# EasyEDA Pro project TLV3501比较器.eprj

# Schematic Schematic1
Board Name: Board1; Create Date: 2025-02-21; Page Name: P1; Project Name: TLV3501比较器; Schematic Name: Schematic1; Update Date: 2025-02-21; Company: 嘉立创EDA; Page Size: A4; Version: V1.0
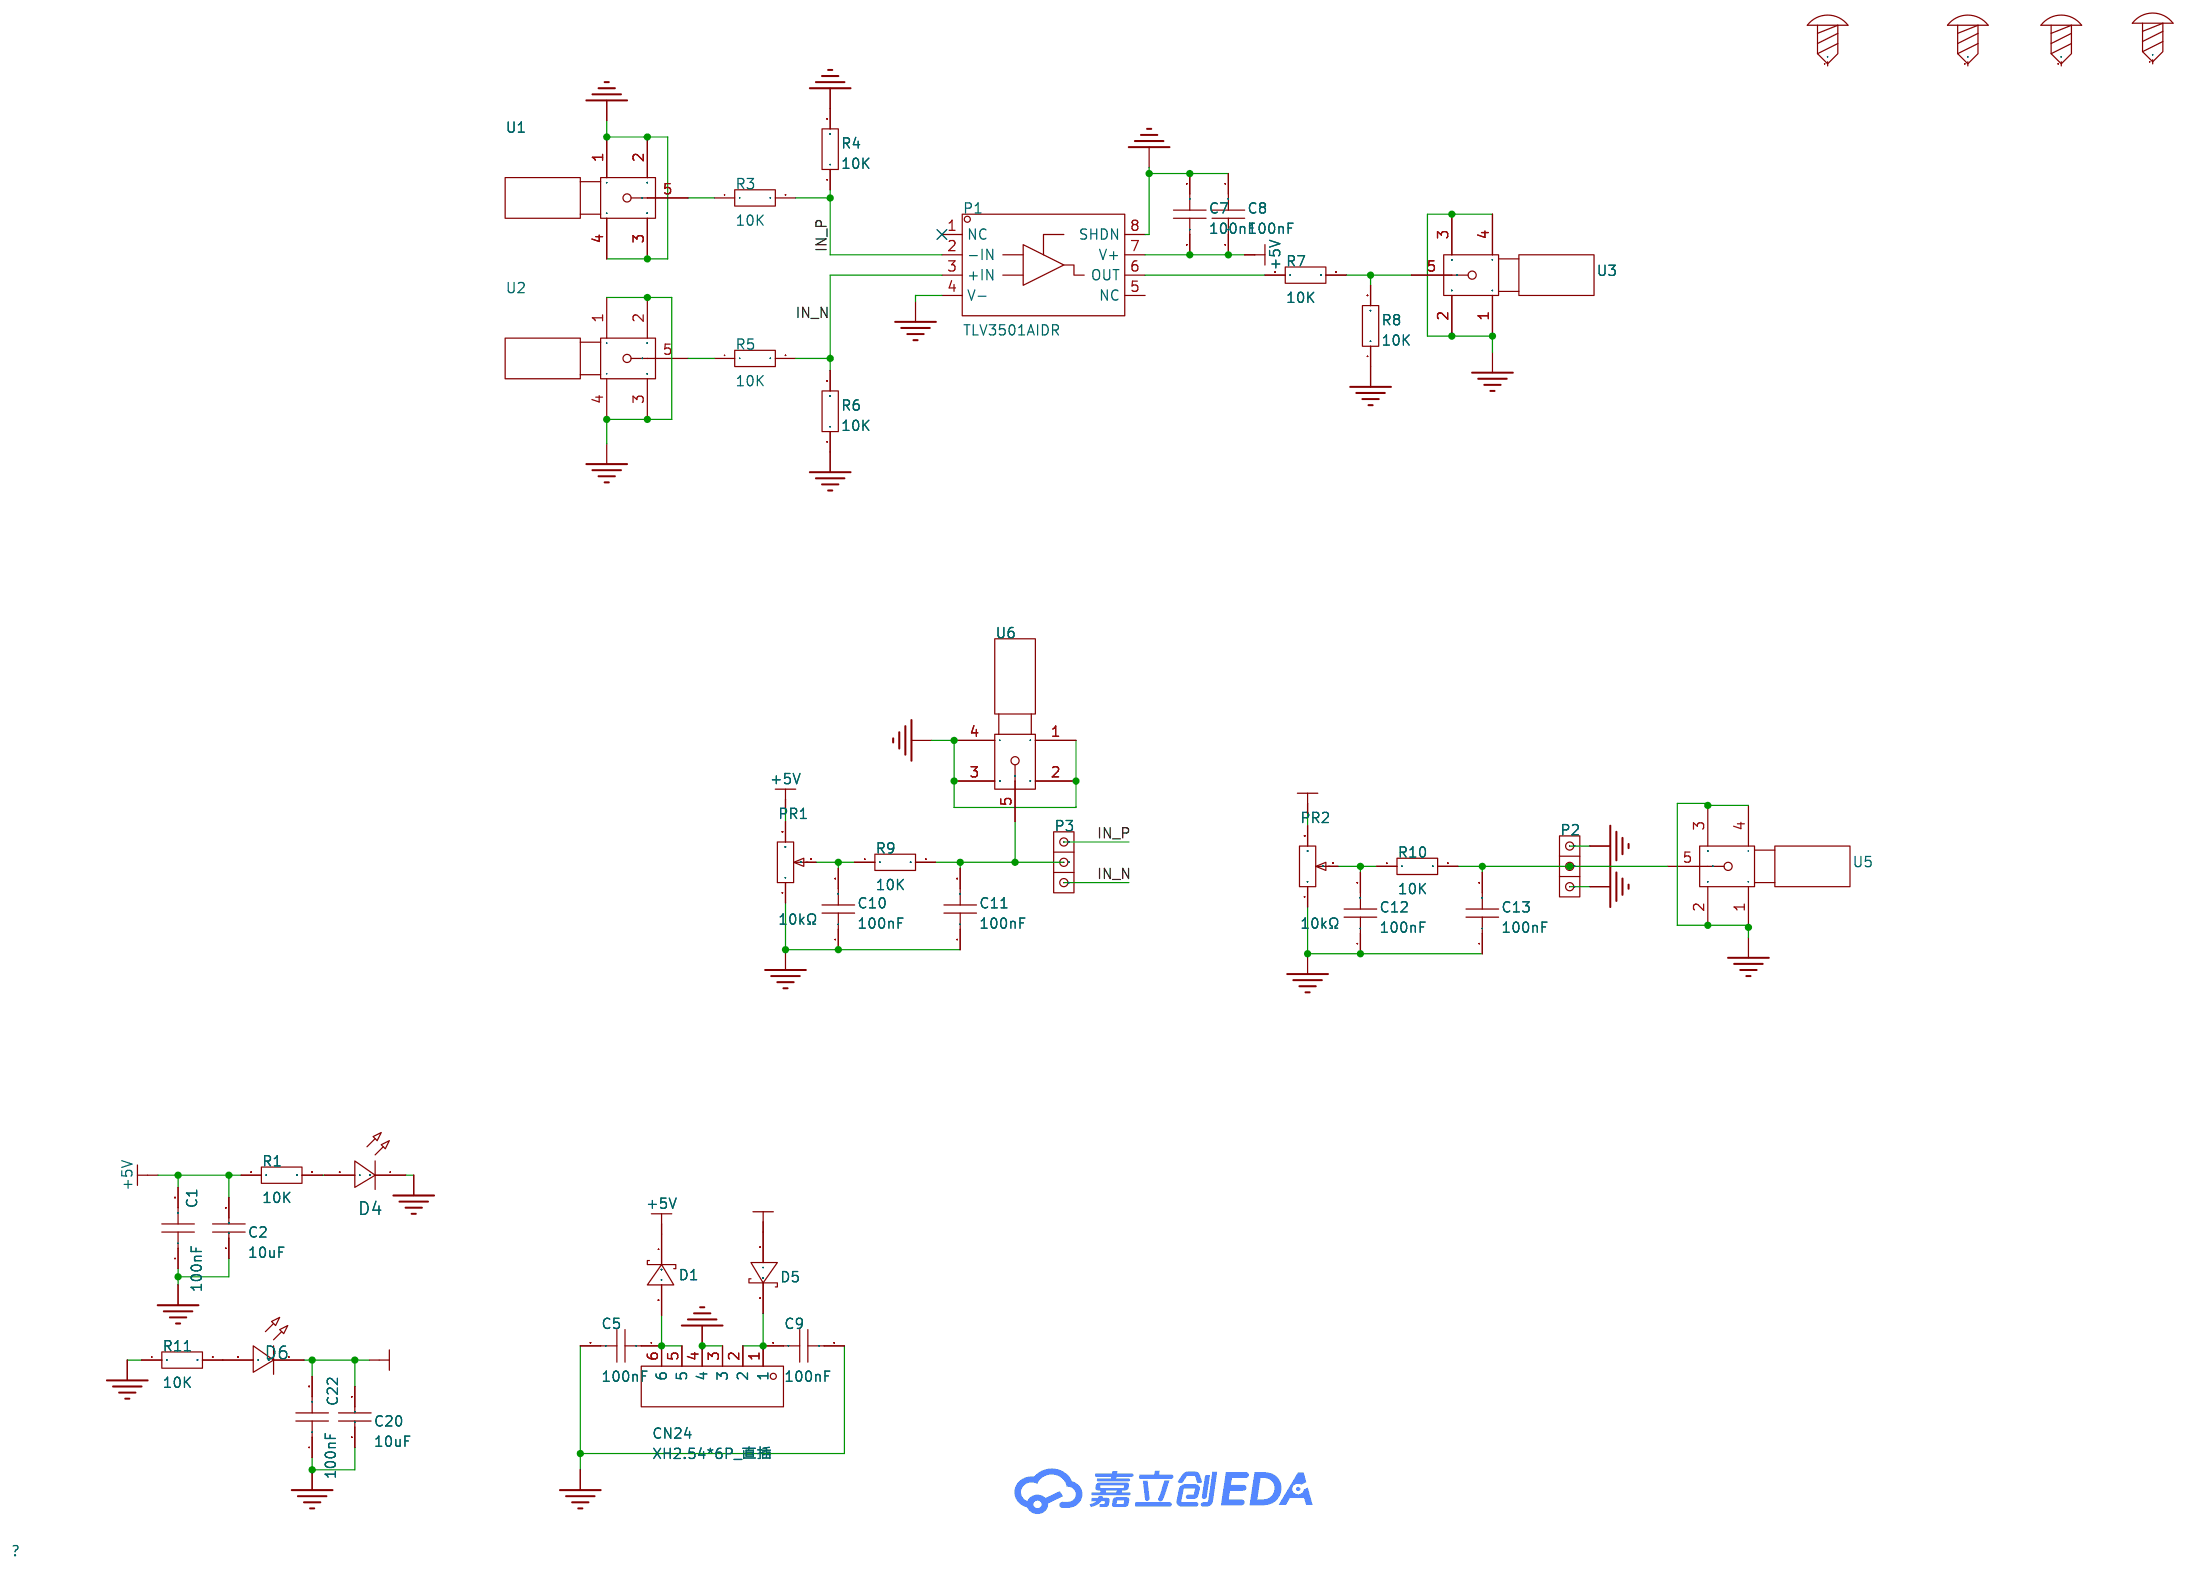
[diagram p0: schematic sheet]

## Parts
C1  100nF  [R0805]
C2  10uF  [C1210]
C5  100nF  [R0805]
C7  100nF  [R0805]
C8  100nF  [R0805]
C9  100nF  [R0805]
C10  100nF  [R0805]
C11  100nF  [R0805]
C12  100nF  [R0805]
C13  100nF  [R0805]
C20  10uF  [C1210]
C22  100nF  [R0805]
CN24  XH2.54*6P_直插  [CONN-TH_XH2.54-6P]
D1  SD103AWS  [SOD-323_L1.8-W1.3-LS2.5-RD]
D4  -  [LED_0805]
D5  SD103AWS  [SOD-323_L1.8-W1.3-LS2.5-RD]
D6  -  [LED_0805]
P1  TLV3501AIDR  [SOP-8_L4.9-W3.9-P1.27-LS6.0-BL]
P2  -  [1*3跳线]
P3  -  [1*3跳线]
PR1  10kΩ  [R_3296]
PR2  10kΩ  [R_3296]
R1  10K  [R0805]
R3  10K  [R0805]
R4  10K  [R0805]
R5  10K  [R0805]
R6  10K  [R0805]
R7  10K  [R0805]
R8  10K  [R0805]
R9  10K  [R0805]
R10  10K  [R0805]
R11  10K  [R0805]
SCREW1  -  [M3螺丝]
SCREW2  -  [M3螺丝]
SCREW3  -  [M3螺丝]
SCREW4  -  [M3螺丝]
U1  -  [SMA]
U2  -  [SMA]
U3  -  [SMA]
U5  -  [SMA]
U6  -  [SMA]

## Library data of the parts
C1 C5 C7-C13 C22 = CAP_0805: Supplier Footprint: 0805
C2 C20 = CL32B106KAJNNNE: 容值:10uF;精度:±10%;额定电压:25V;材质(温度系数):X7R;; LCSC Part Name: 10uF ±10% 25V; Supplier Part: C39232; Manufacturer: SAMSUNG(三星); Supplier Footprint: 1210; JLCPCB Part Class: 扩展库; Datasheet: https://atta.szlcsc.com/upload/public/pdf/source/20160218/1457707763339.pdf; Supplier: LCSC; Tolerance: ±10%; Voltage Rated: 25V; Temperature Coefficient: X7R
CN24 = XH2.54*6P_直插: Supplier Part: C9900008614; Supplier Footprint: XH2.54_6P; JLCPCB Part Class: 扩展库; Supplier: LCSC
D1 D5 = SD103AWS_C181207: 正向压降(Vf):600mV@200mA;直流反向耐压(Vr):40V;整流电流:350mA;; LCSC Part Name: 电压:40V 电流:350mA 丝印S4; Supplier Part: C181207; Manufacturer: Hottech(合科泰); Supplier Footprint: SOD-323; JLCPCB Part Class: 扩展库; Datasheet: https://atta.szlcsc.com/upload/public/pdf/source/20240513/4691873FBB9173EFBCF4C6FD4BBA1025.pdf; Supplier: LCSC; Forward Voltage (Vf@If): 600mV@200mA; Reverse Voltage (Vr): 40V; Rectified Current: 350mA
D4 D6 = LED_0805-R: Supplier Footprint: 0805
P1 = TLV3501AIDR: Supplier Part: C43484; Manufacturer: TI(德州仪器); Supplier Footprint: SOP-8; JLCPCB Part Class: 扩展库; Datasheet: https://www.ti.com/cn/lit/gpn/tlv3501; Supplier: LCSC; Input Offset Voltage (Vos): 6.5mV; Input Bias Current (Ib): 10pA; Propagation Delay Time: 10ns; Input Hysteresis Voltage (Vhys): 6mV; Common Mode Rejection Ratio (CMRR): 70dB; Supply Voltage: 1.35V~2.75V；2.7V~5.5V; Output Type: 推挽; Output Mode: TTL；CMOS; Supply Current: 5mA; Operating Temperature: -40℃~+125℃
P2 P3 = 1*3跳线
PR1 PR2 = R_3296: Supplier Footprint: 直插
R1 R3-R11 = Res_0805: Supplier Footprint: 0805
SCREW1-SCREW4 = M3螺丝: Supplier Footprint: 插件
U1-U3 U5 U6 = SMA

## Nets
+5V: C1.2 C2.2 C7.2 C8.2 D1.1(C) P1.7(V+) PR1.3 R1.1
-5V: C20.2 C22.2 D5.2(A) D6.1(C) PR2.3
GND: C1.1 C2.1 C5.2 C7.1 C8.1 C9.1 C10.1 C11.1 C12.1 C13.1 C20.1 C22.1 CN24.3 CN24.4 D4.1(C) P1.4(V-) P1.8(SHDN) P2.1 P2.3 PR1.1 PR2.1 R4.2 R6.1 R8.1 R11.1 U1.1 U1.2 U1.3 U1.4 U2.1 U2.2 U2.3 U2.4 U3.1 U3.2 U3.3 U3.4 U5.1 U5.2 U5.3 U5.4 U6.1 U6.2 U6.3 U6.4
IN_N: P1.3(+IN) P3.3 R5.2 R6.2
IN_P: P1.2(-IN) P3.1 R3.2 R4.1
$1N562: C9.2 CN24.1 CN24.2 D5.1(C)
$1N571: C5.1 CN24.5 CN24.6 D1.2(A)
$1N573: D4.2(A) R1.2
$1N1078: R5.1 U2.5
$1N1083: R3.1 U1.5
$1N1088: R7.2 R8.2 U3.5
$1N1092: P1.6(OUT) R7.1
$1N1631: C10.2 PR1.2 R9.1
$1N1638: C11.2 P3.2 R9.2 U6.5
$1N1904: C12.2 PR2.2 R10.1
$1N1908: C13.2 P2.2 R10.2 U5.5
$1N2604: D6.2(A) R11.2

Not connected (* = marked no-connect by the designer): P1 1(NC)* 5(NC); SCREW1 1; SCREW2 1; SCREW3 1; SCREW4 1

# Board PCB1
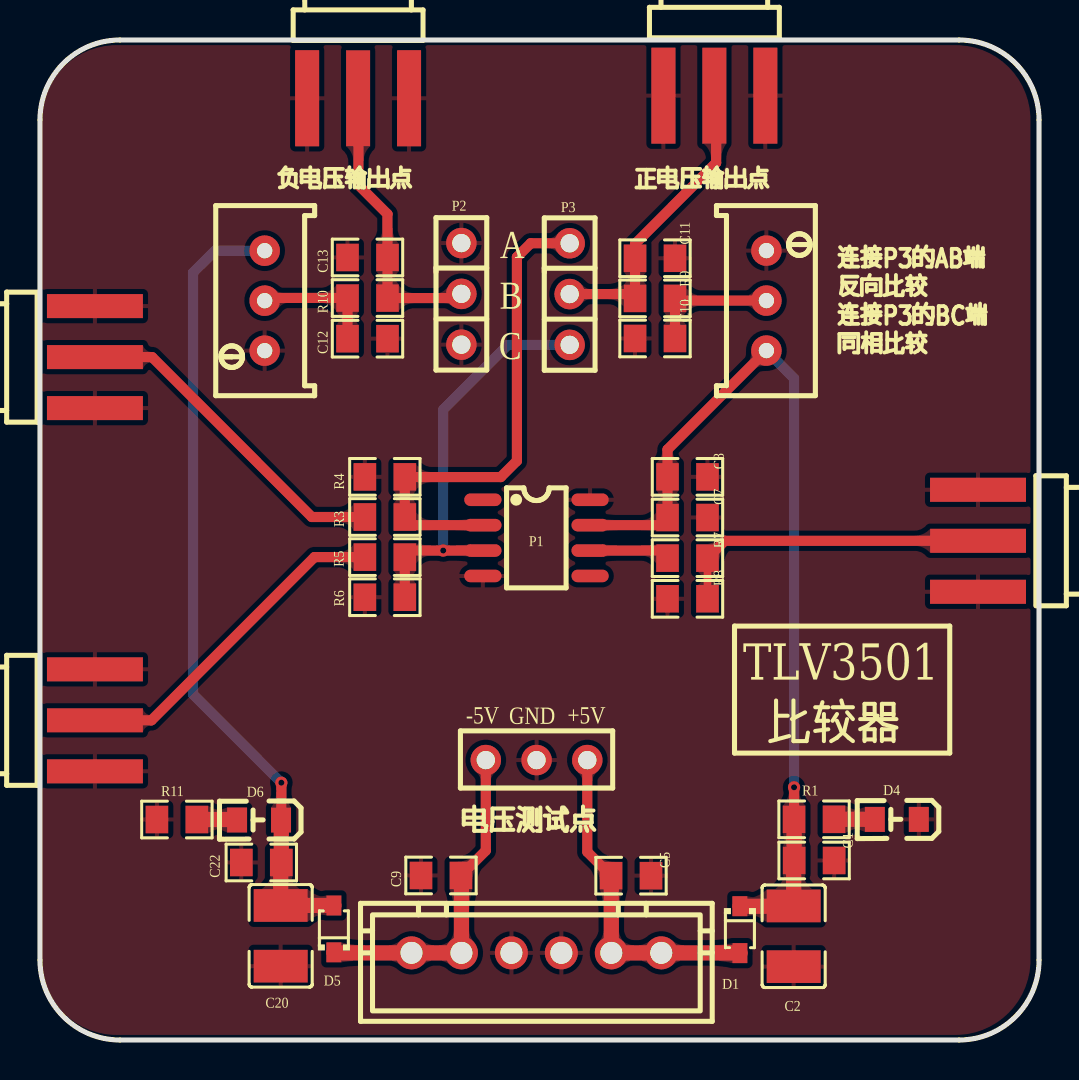
[diagram p1: board, top side]
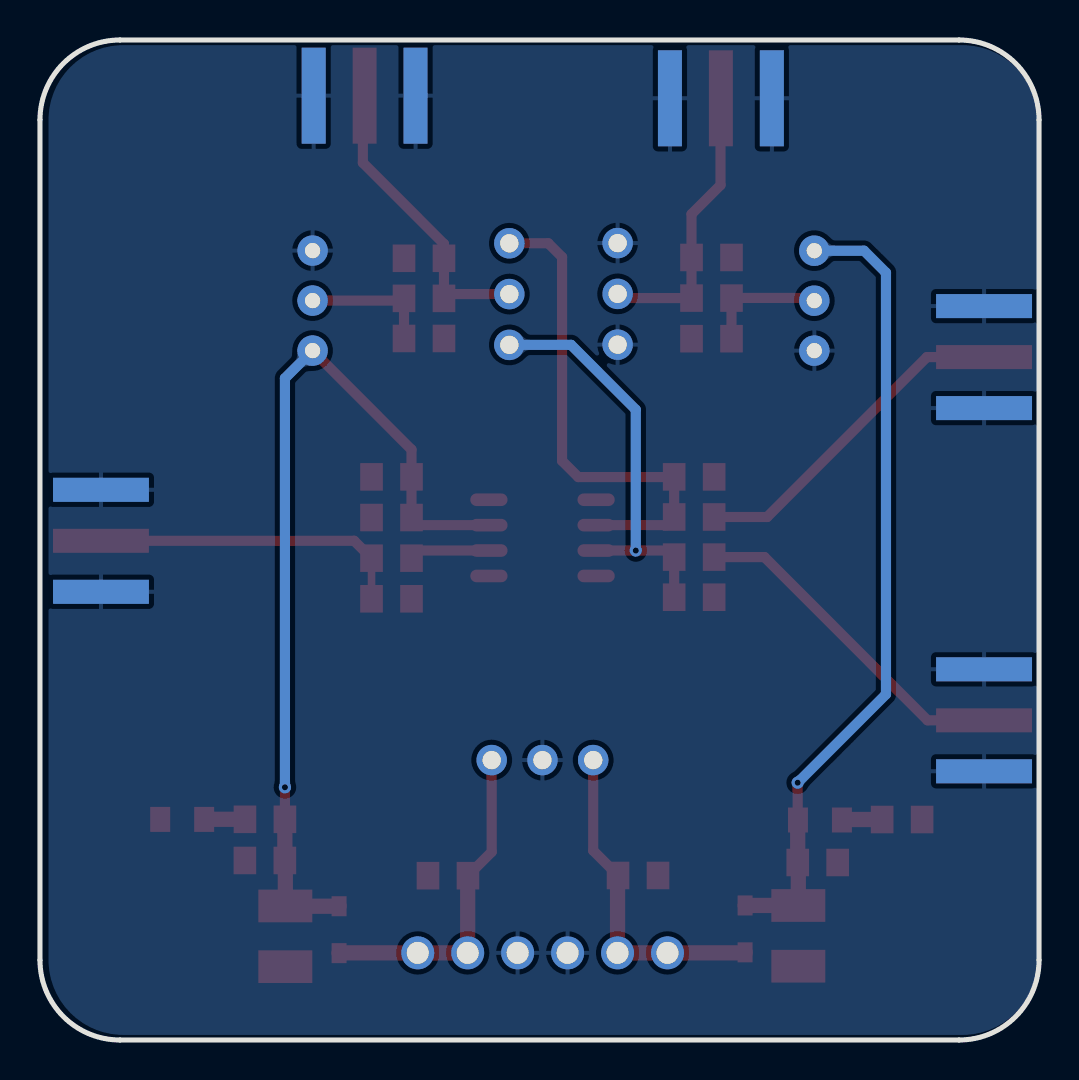
[diagram p2: board, bottom side, seen from below]

Outline 50 x 50 mm; copper layers: Top Layer, Bottom Layer. Coordinates in mm from the lower left corner of the outline.
Outline path: 0,46 0,4 arc(1.17,1.17) 4,0 46,0 arc(48.83,1.17) 50,4 50,46 arc(48.83,48.83) 46,50 4,50 arc(1.17,48.83) 0,46
Stack: Top Layer 0.035mm / Dielectric1 1.51mm FR4 er 4.5 / Bottom Layer 0.035mm

## Design rules (mm)
template: 自定义配置
spacing copperThickness1oz (default): track to track 0.102, other pairs 0.152 to 0.3
spacing copperThickness2oz: track to track 0.203, other pairs 0.152 to 0.3
track width copperThickness1oz (default): min 0.127, default 0.381, max 2.54
track width copperThickness2oz: min 0.203, default 0.254, max 2.54
differential pair differentialPair (default): width min 0.127, default 0.254, max 2.54; gap min 0.152, default 0.152
via viaSize (default): diameter min 0.5, default 0.61, max 10; hole min 0.3, default 0.305, max 6.3

## Placement (name value [footprint] x y rotation side)
C1  100nF  [R0805]  38.63 8.98 180 top
C2  10uF  [C1210]  37.72 5.19 90 top
C5  100nF  [R0805]  29.69 8.22 0 top
C7  100nF  [R0805]  32.3 26.12 180 top
C8  100nF  [R0805]  32.3 28.16 180 top
C9  100nF  [R0805]  20.18 8.23 0 top
C10  100nF  [R0805]  30.89 35.08 0 top
C11  100nF  [R0805]  30.67 39.09 180 top
C12  100nF  [R0805]  16.28 35.07 180 top
C13  100nF  [R0805]  16.5 39.13 0 top
C20  10uF  [C1210]  12.05 5.21 90 top
C22  100nF  [R0805]  11.19 8.88 0 top
CN24  XH2.54*6P_直插  [CONN-TH_XH2.54-6P]  24.84 4.36 0 top
D1  SD103AWS  [SOD-323_L1.8-W1.3-LS2.5-RD]  35.03 5.52 270 top
D4  -  [LED_0805]  42.83 11.03 180 top
D5  SD103AWS  [SOD-323_L1.8-W1.3-LS2.5-RD]  14.71 5.56 90 top
D6  -  [LED_0805]  10.91 11 180 top
NOREF  -  [Pad_e50]  27.39 14 0 top
NOREF#2  -  [Pad_e49]  24.85 14 0 top
NOREF#3  -  [Pad_e48]  22.31 14 0 top
P1  TLV3501AIDR  [SOP-8_L4.9-W3.9-P1.27-LS6.0-BL]  24.85 25.11 270 top
P2  -  [1*3跳线]  21.09 34.77 0 top
P3  -  [1*3跳线]  26.51 34.76 0 top
PR1  10kΩ  [R_3296]  36.48 36.97 270 top
PR2  10kΩ  [R_3296]  11.12 36.97 90 top
R1  10K  [R0805#2]  38.74 11.03 0 top
R3  10K  [R0805#2]  17.26 26.15 0 top
R4  10K  [R0805#2]  17.26 28.16 180 top
R5  10K  [R0805#2]  17.26 24.14 0 top
R6  10K  [R0805#2]  17.26 22.14 0 top
R7  10K  [R0805#2]  32.41 24.09 0 top
R8  10K  [R0805#2]  32.41 22.06 0 top
R9  10K  [R0805#2]  30.78 37.08 180 top
R10  10K  [R0805#2]  16.39 37.1 0 top
R11  10K  [R0805#2]  6.85 11.02 0 top
U1  -  [SMA]  -1.06 28.28 0 top
U2  -  [SMA]  -1.06 10.12 0 top
U3  -  [SMA]  50.76 30.82 180 top
U5  -  [SMA]  10.06 50.9 270 top
U6  -  [SMA]  27.89 51.03 270 top

## Footprints (pads in the part's own frame, mm; a bottom-side part is the same pattern mirrored in y, then rotated)
1*3跳线
  round 1.524 hole 0.914: 1(0,5.08) 2(0,2.54) 3(0,0)
C1210
  rect 1.635x2.7 smd: 1(-1.518,0) 2(1.518,0)
CONN-TH_XH2.54-6P
  round 1.65 hole 1.1: 1(-6.25,0) 2(-3.75,0) 3(-1.25,0) 4(1.25,0) 5(3.75,0) 6(6.25,0)
LED_0805
  rect 1x1.25 smd: 1(-1.15,0.005) 2(1.05,0.005)
Pad_e48
  round 1.524 hole 0.914: 1(0,0)
Pad_e49
  round 1.524 hole 0.914: 2(0,0)
Pad_e50
  round 1.524 hole 0.914: 3(0,0)
R0805
  rect 1.133x1.377 smd: 1(-1.111,0) 2(0.889,0)
R0805#2
  rect 1.133x1.377 smd: 1(-1,0) 2(1,0)
R_3296
  round 1.524 hole 0.762: 1(-2.499,-0.127) 2(0,-0.127) 3(2.499,-0.127)
SMA
  rect 4.8x1.2 smd: 1(3.81,8.412) 2(3.81,3.312) 5(3.81,5.862)
  rect 4.8x1.2 smd far side: 3(3.81,3.312) 4(3.81,8.412)
SOD-323_L1.8-W1.3-LS2.5-RD
  rect 1x0.75 smd: 1(-1.173,0) 2(1.173,0)
SOP-8_L4.9-W3.9-P1.27-LS6.0-BL
  oval 0.63x1.865 smd: 1(-1.905,-2.683) 2(-0.635,-2.683) 3(0.635,-2.683) 4(1.905,-2.683) 5(1.905,2.683) 6(0.635,2.683) 7(-0.635,2.683) 8(-1.905,2.683)

## Nets
As in the schematic, except:
GND: C1.1 C2.1 C5.2 C7.1 C8.1 C9.1 C10.1 C11.1 C12.1 C13.1 C20.1 C22.1 CN24.3 CN24.4 D4.1 NOREF#2.2 P1.4 P1.8 P2.1 P2.3 PR1.1 PR2.1 R4.2 R6.1 R8.1 R11.1 U1.1 U1.2 U1.3 U1.4 U2.1 U2.2 U2.3 U2.4 U3.1 U3.2 U3.3 U3.4 U5.1 U5.2 U5.3 U5.4 U6.1 U6.2 U6.3 U6.4
$1N562: C9.2 CN24.1 CN24.2 D5.1 NOREF#3.1
$1N571: C5.1 CN24.5 CN24.6 D1.2 NOREF.3

Pads without a net: P1 1 5

## Via types
v1: diameter 0.61, hole 0.305, Top Layer to Bottom Layer, 3 vias

## Routing (per net, layer and track width the routed paths; a pad name or vN(x,y) marks a point on that pad's centre or on a via; arc(x,y) is an arc through that point)
+5V: length 45.5
  Top Layer w0.508: PR1.3 31.41,29.52 C8.2 C7.2 31.02,25.74 P1.7 ; R1.1 v1(37.74,12.64)
  Top Layer w0.762: R1.1 37.74,11.03 C1.2 37.72,8.95 C2.2 37.7,6.69 D1.1
  Bottom Layer w0.508: v1(37.74,12.64) 37.74,33.09 PR1.3
-5V: length 40.7
  Top Layer w0.508: v1(12.08,12.87) 12.08,10.47 12.08,10.47
  Top Layer w0.762: 12.07,11 12.08,10.99 C22.2 12.05,8.84 C20.2 12.05,6.73 D5.2
  Bottom Layer w0.508: PR2.3 8.76,39.47 7.66,38.37 7.66,17.29 v1(12.08,12.87)
IN_N: length 20.8
  Top Layer w0.508: 22.17,24.47 v1(20.18,24.47) 18.59,24.47 R5.2 R6.2
  Bottom Layer w0.508: P3.3 23.42,34.76 20.18,31.52 v1(20.18,24.47)
IN_P: length 25.1
  Top Layer w0.508: P1.2 18.67,25.74 R3.2 R4.1 18.27,28.15 23.06,28.15 23.87,28.96 23.87,39.15 24.56,39.84 P3.1
$1N562: length 16.6
  Top Layer w0.508: NOREF#3.1 22.31,9.47 C9.2
  Top Layer w0.762: D5.1 14.74,4.36 CN24.1 CN24.2 21.09,8.2 C9.2
$1N571: length 16.6
  Top Layer w0.508: NOREF.3 27.39,9.41 C5.1
  Top Layer w0.762: C5.1 28.59,8.2 CN24.5 CN24.6 35.02,4.36 D1.2
$1N573: length 2
  Top Layer w0.762: R1.2 41.78,11.03 D4.2
$1N1078: length 16.9
  Top Layer w0.508: U2.5 5.58,15.98 13.74,24.14 R5.1
$1N1083: length 16.8
  Top Layer w0.508: U1.5 5.61,34.14 13.61,26.15 R3.1
$1N1088: length 15.9
  Top Layer w0.381: R8.2 R7.2
  Top Layer w0.508: U3.5 34.27,24.96 R7.2
$1N1092: length 4
  Top Layer w0.508: 27.53,24.47 31.02,24.47 R7.1
$1N1631: length 6.5
  Top Layer w0.508: C10.2 R9.1 ; 31.78,37.1 31.79,37.09 ; 31.91,36.97 PR1.2
$1N1638: length 15.2
  Top Layer w0.508: P3.2 29.57,37.3 R9.2 C11.2 29.78,39.8 33.84,43.86 33.84,47.13 U6.5
$1N1904: length 6.2
  Top Layer w0.508: PR2.2 11.38,37.1 15.39,37.1 ; C12.2 R10.1
$1N1908: length 14.4
  Top Layer w0.508: P2.2 20.88,37.1 R10.2 C13.2 17.39,41.29 15.94,42.75 15.94,47.07 U5.5
$1N2604: length 2
  Top Layer w0.762: R11.2 9.84,11.02 D6.2

## Copper pours and planes (outline as drawn; the poured copper is in the pictures)
GND on Top Layer: -6.18,54.12 53.65,54.12 53.65,-4.55 -6.18,-4.55
GND on Bottom Layer: -5.84,53.6 53.65,53.6 53.65,-4.16 -5.84,-4.16

Small or netless copper shapes (teardrops, artwork), in the pictures only: 82 on Top Layer, 6 on Bottom Layer

## Text on the board
Top Silkscreen Layer: -5V | GND | +5V | 正电压输出点 | 连接P3的AB端 / 反向比较 / 连接P3的BC端 / 同相比较 | 负电压输出点 | 电压测试点 | C | B | A | TLV3501 | 比较器
